# EAGLE design instrument_generic (EAGLE 9.2.2)
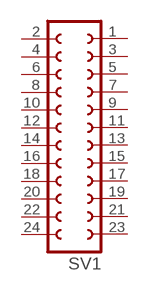
[diagram p0: schematic, sheet 1]

## Parts
SV1  FE12-2  [FE12-2]
Unconnected: SV1.1 SV1.2 SV1.3 SV1.4 SV1.5 SV1.6 SV1.7 SV1.8 SV1.9 SV1.10 SV1.11 SV1.12 SV1.13 SV1.14 SV1.15 SV1.16 SV1.17 SV1.18 SV1.19 SV1.20 SV1.21 SV1.22 SV1.23 SV1.24

## Library data of the parts
SV1 = con-lsta:FE12-2: FEMALE HEADER; OC_FARNELL: unknown; OC_NEWARK: unknown

## Board
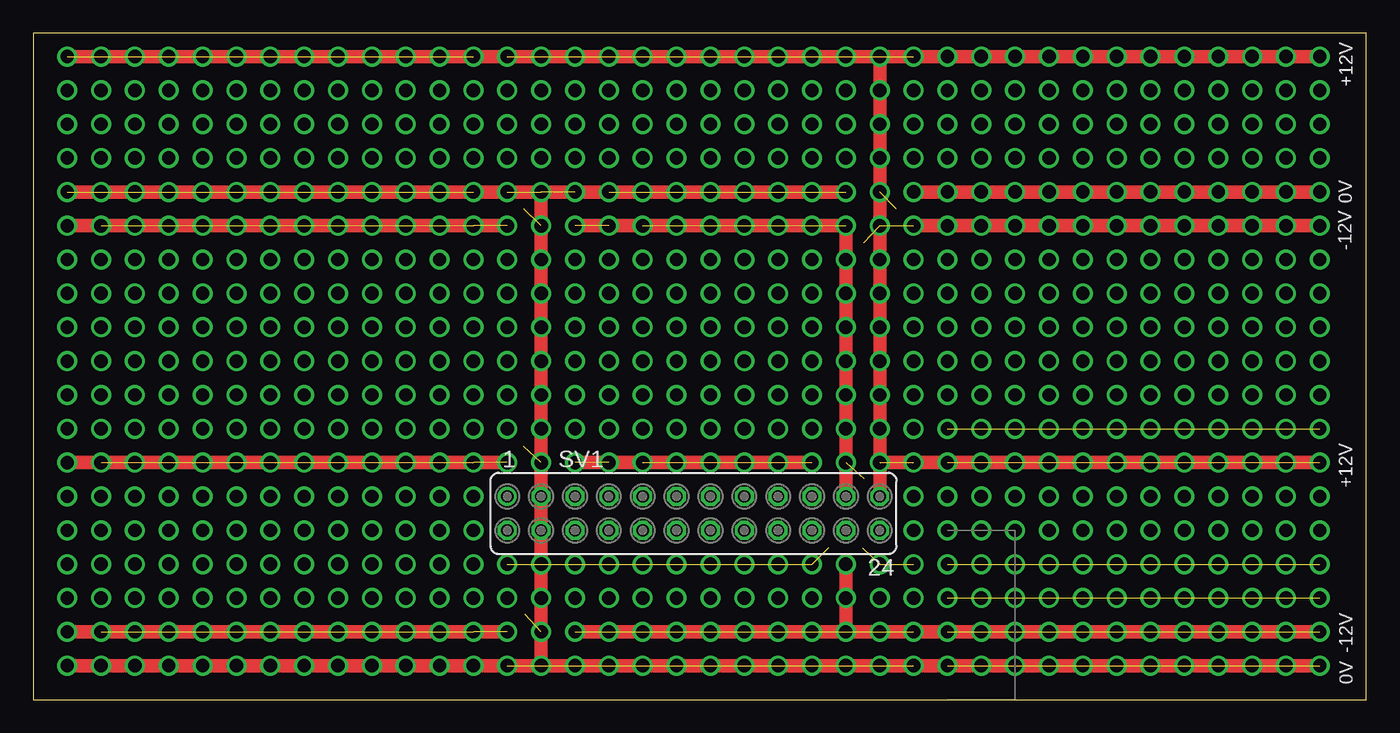
[diagram p1: board, top side]
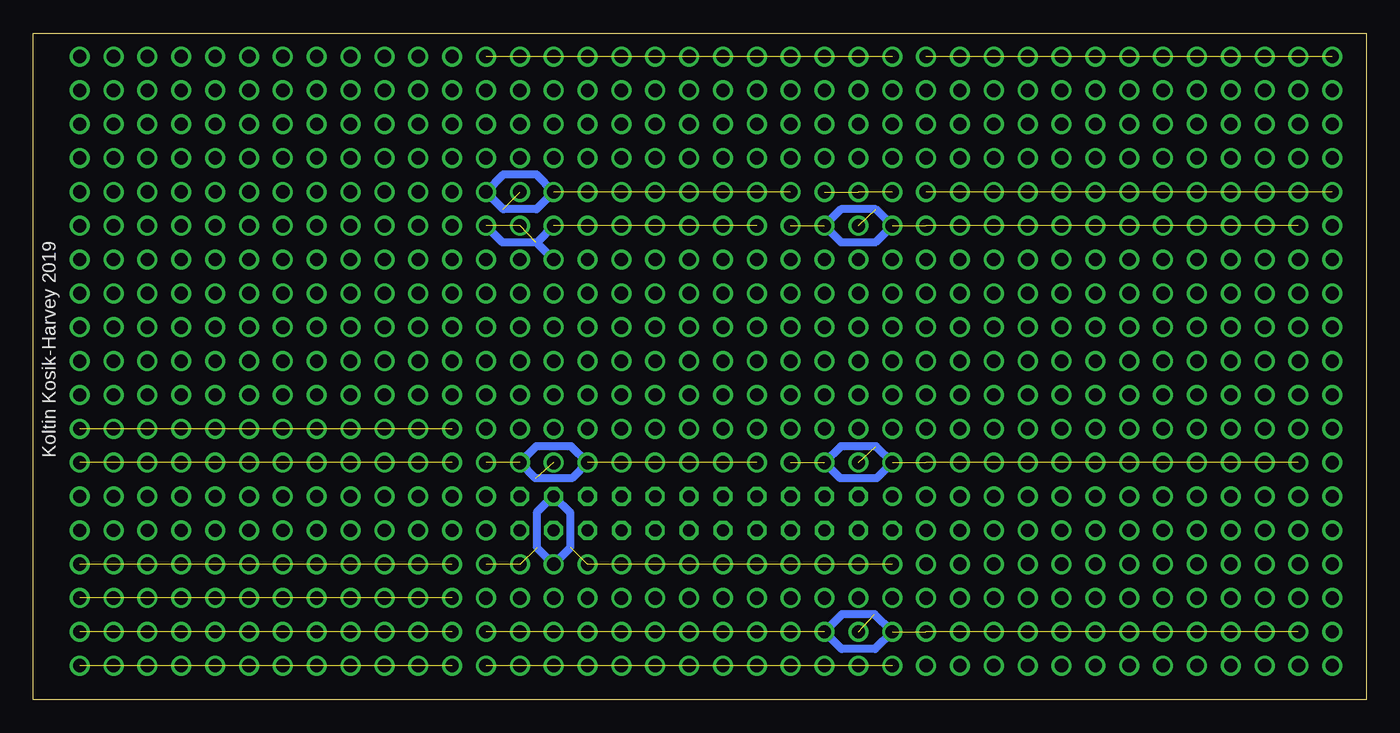
[diagram p2: board, bottom side, seen from below]

Size 100 x 50 mm. Coordinates in mm from the lower left corner, seen from the top.
Outline: 0,0 100,0 100,50 0,50 0,0
Copper layers (1*16): Top 0.035mm / dielectric 1.5mm / Bottom 0.035mm
Design rules "default": minimum track width 6mil, minimum drill 0.35mm, track to track 6mil, track to pad 6mil, pad to pad 6mil, via to via 6mil, smd to smd 6mil, copper to edge 40mil, drill to drill 6mil, minimum pad ring 10mil, minimum via ring 8mil, stop-mask expansion 4mil, vias tented up to drill 0mil, thermal gap 10mil

### Footprints (pad centres in the part's own frame; a part is rotated, then mirrored left to right if it is on the bottom)
FE12-2 = drill 0.914: 1 -13.97,1.27 | drill 0.914 octagon: 2 -13.97,-1.27; 3 -11.43,1.27; 4 -11.43,-1.27; 5 -8.89,1.27; 6 -8.89,-1.27; 7 -6.35,1.27; 8 -6.35,-1.27; 9 -3.81,1.27; 10 -3.81,-1.27; 11 -1.27,1.27; 12 -1.27,-1.27; 13 1.27,1.27; 14 1.27,-1.27; 15 3.81,1.27; 16 3.81,-1.27; 17 6.35,1.27; 18 6.35,-1.27; 19 8.89,1.27; 20 8.89,-1.27; 21 11.43,1.27; 22 11.43,-1.27; 23 13.97,1.27; 24 13.97,-1.27

### Placement (x,y rotation side)
SV1  49.53,13.97 0 top

### Tracks (layer width: path | path; a pad name or v marks a point on that pad's centre or on a via)
N$1  (via drill 1)
  other vias: 33.02,12.7 30.48,12.7 27.94,12.7 25.4,12.7 22.86,12.7 20.32,12.7 17.78,12.7 15.24,12.7 12.7,12.7 10.16,12.7 7.62,12.7 5.08,12.7 2.54,12.7
N$2  (via drill 1)
  other vias: 33.02,10.16 30.48,10.16 27.94,10.16 25.4,10.16 22.86,10.16 20.32,10.16 17.78,10.16 15.24,10.16 12.7,10.16 10.16,10.16 7.62,10.16 5.08,10.16 2.54,10.16
N$3  (via drill 1)
  other vias: 33.02,7.62 30.48,7.62 27.94,7.62 25.4,7.62 22.86,7.62 20.32,7.62 17.78,7.62 15.24,7.62 12.7,7.62 10.16,7.62 7.62,7.62 5.08,7.62 2.54,7.62
N$4  (via drill 1)
  other vias: 33.02,20.32 30.48,20.32 27.94,20.32 25.4,20.32 22.86,20.32 20.32,20.32 17.78,20.32 15.24,20.32 12.7,20.32 10.16,20.32 7.62,20.32 5.08,20.32 2.54,20.32
N$5  (via drill 1)  (12 unrouted)
  Top 1.016: v2.54,17.78 35.56,17.78
  other vias: 33.02,17.78 30.48,17.78 27.94,17.78 25.4,17.78 22.86,17.78 20.32,17.78 17.78,17.78 15.24,17.78 12.7,17.78 10.16,17.78 7.62,17.78 5.08,17.78
N$6  (via drill 1)
  other vias: 33.02,15.24 30.48,15.24 27.94,15.24 25.4,15.24 22.86,15.24 20.32,15.24 17.78,15.24 15.24,15.24 12.7,15.24 10.16,15.24 7.62,15.24 5.08,15.24 2.54,15.24
N$7  (via drill 1)  (12 unrouted)
  Top 1.016: v2.54,5.08 35.56,5.08
  other vias: 33.02,5.08 30.48,5.08 27.94,5.08 25.4,5.08 22.86,5.08 20.32,5.08 17.78,5.08 15.24,5.08 12.7,5.08 10.16,5.08 7.62,5.08 5.08,5.08
N$8  (via drill 1)
  other vias: 33.02,2.54 30.48,2.54 27.94,2.54 25.4,2.54 22.86,2.54 20.32,2.54 17.78,2.54 15.24,2.54 12.7,2.54 10.16,2.54 7.62,2.54 5.08,2.54 2.54,2.54
N$9  (via drill 1)  (12 unrouted)
  Top 1.016: v60.96,10.16 60.96,5.08 40.64,5.08
  Bottom 0.61: v60.96,10.16 59.7,11.42 59.7,14 61,15.3 62.2,14.1 62.2,11.4 v60.96,10.16
  other vias: 66.04,10.16 63.5,10.16 58.42,10.16 55.88,10.16 53.34,10.16 50.8,10.16 48.26,10.16 45.72,10.16 43.18,10.16 40.64,10.16 38.1,10.16 35.56,10.16
N$10  (via drill 1)
  other vias: 66.04,7.62 63.5,7.62 60.96,7.62 58.42,7.62 55.88,7.62 53.34,7.62 50.8,7.62 48.26,7.62 45.72,7.62 43.18,7.62 40.64,7.62 38.1,7.62 35.56,7.62
N$11  (via drill 1)  (11 unrouted)
  Top 1.016: v60.96,5.08 96.52,5.08
  Bottom 0.61: v35.56,5.08 36.84,3.8 39.36,3.8 v40.64,5.08 39.32,6.4 36.88,6.4 v35.56,5.08
  other vias: 66.04,5.08 63.5,5.08 58.42,5.08 55.88,5.08 53.34,5.08 50.8,5.08 48.26,5.08 45.72,5.08 43.18,5.08 38.1,5.08
N$12  (via drill 1)  (12 unrouted)
  Top 1.016: v38.1,2.54 2.54,2.54
  other vias: 66.04,2.54 63.5,2.54 60.96,2.54 58.42,2.54 55.88,2.54 53.34,2.54 50.8,2.54 48.26,2.54 45.72,2.54 43.18,2.54 40.64,2.54 35.56,2.54
N$13  (via drill 1)  (11 unrouted)
  other vias: 96.52,10.16 93.98,10.16 91.44,10.16 88.9,10.16 86.36,10.16 83.82,10.16 81.28,10.16 78.74,10.16 76.2,10.16 73.66,10.16 71.12,10.16 68.58,10.16
N$14  (via drill 1)  (11 unrouted)
  other vias: 96.52,7.62 93.98,7.62 91.44,7.62 88.9,7.62 86.36,7.62 83.82,7.62 81.28,7.62 78.74,7.62 76.2,7.62 73.66,7.62 71.12,7.62 68.58,7.62
N$15  (via drill 1)  (11 unrouted)
  other vias: 96.52,5.08 93.98,5.08 91.44,5.08 88.9,5.08 86.36,5.08 83.82,5.08 81.28,5.08 78.74,5.08 76.2,5.08 73.66,5.08 71.12,5.08 68.58,5.08
N$16  (via drill 1)  (11 unrouted)
  other vias: 96.52,2.54 93.98,2.54 91.44,2.54 88.9,2.54 86.36,2.54 83.82,2.54 81.28,2.54 78.74,2.54 76.2,2.54 73.66,2.54 71.12,2.54 68.58,2.54
N$17  (via drill 1)
  other vias: 33.02,30.48 30.48,30.48 27.94,30.48 25.4,30.48 22.86,30.48 20.32,30.48 17.78,30.48 15.24,30.48 12.7,30.48 10.16,30.48 7.62,30.48 5.08,30.48 2.54,30.48
N$18  (via drill 1)
  other vias: 33.02,27.94 30.48,27.94 27.94,27.94 25.4,27.94 22.86,27.94 20.32,27.94 17.78,27.94 15.24,27.94 12.7,27.94 10.16,27.94 7.62,27.94 5.08,27.94 2.54,27.94
N$19  (via drill 1)
  other vias: 33.02,25.4 30.48,25.4 27.94,25.4 25.4,25.4 22.86,25.4 20.32,25.4 17.78,25.4 15.24,25.4 12.7,25.4 10.16,25.4 7.62,25.4 5.08,25.4 2.54,25.4
N$20  (via drill 1)
  other vias: 33.02,22.86 30.48,22.86 27.94,22.86 25.4,22.86 22.86,22.86 20.32,22.86 17.78,22.86 15.24,22.86 12.7,22.86 10.16,22.86 7.62,22.86 5.08,22.86 2.54,22.86
N$21  (via drill 1)
  other vias: 66.04,30.48 63.5,30.48 60.96,30.48 58.42,30.48 55.88,30.48 53.34,30.48 50.8,30.48 48.26,30.48 45.72,30.48 43.18,30.48 40.64,30.48 38.1,30.48 35.56,30.48
N$22  (via drill 1)
  other vias: 66.04,27.94 63.5,27.94 60.96,27.94 58.42,27.94 55.88,27.94 53.34,27.94 50.8,27.94 48.26,27.94 45.72,27.94 43.18,27.94 40.64,27.94 38.1,27.94 35.56,27.94
N$23  (via drill 1)
  other vias: 66.04,25.4 63.5,25.4 60.96,25.4 58.42,25.4 55.88,25.4 53.34,25.4 50.8,25.4 48.26,25.4 45.72,25.4 43.18,25.4 40.64,25.4 38.1,25.4 35.56,25.4
N$24  (via drill 1)
  other vias: 66.04,22.86 63.5,22.86 60.96,22.86 58.42,22.86 55.88,22.86 53.34,22.86 50.8,22.86 48.26,22.86 45.72,22.86 43.18,22.86 40.64,22.86 38.1,22.86 35.56,22.86
N$25  (via drill 1)
  other vias: 96.52,30.48 93.98,30.48 91.44,30.48 88.9,30.48 86.36,30.48 83.82,30.48 81.28,30.48 78.74,30.48 76.2,30.48 73.66,30.48 71.12,30.48 68.58,30.48
N$26  (via drill 1)
  other vias: 96.52,27.94 93.98,27.94 91.44,27.94 88.9,27.94 86.36,27.94 83.82,27.94 81.28,27.94 78.74,27.94 76.2,27.94 73.66,27.94 71.12,27.94 68.58,27.94
N$27  (via drill 1)
  other vias: 96.52,25.4 93.98,25.4 91.44,25.4 88.9,25.4 86.36,25.4 83.82,25.4 81.28,25.4 78.74,25.4 76.2,25.4 73.66,25.4 71.12,25.4 68.58,25.4
N$28  (via drill 1)
  other vias: 96.52,22.86 93.98,22.86 91.44,22.86 88.9,22.86 86.36,22.86 83.82,22.86 81.28,22.86 78.74,22.86 76.2,22.86 73.66,22.86 71.12,22.86 68.58,22.86
N$29  (via drill 1)
  other vias: 33.02,40.64 30.48,40.64 27.94,40.64 25.4,40.64 22.86,40.64 20.32,40.64 17.78,40.64 15.24,40.64 12.7,40.64 10.16,40.64 7.62,40.64 5.08,40.64 2.54,40.64
N$30  (via drill 1)  (12 unrouted)
  Top 1.016: v2.54,38.1 38.1,38.1
  other vias: 33.02,38.1 30.48,38.1 27.94,38.1 25.4,38.1 22.86,38.1 20.32,38.1 17.78,38.1 15.24,38.1 12.7,38.1 10.16,38.1 7.62,38.1 5.08,38.1
N$31  (via drill 1)  (12 unrouted)
  Top 1.016: v2.54,35.56 35.56,35.56
  other vias: 33.02,35.56 30.48,35.56 27.94,35.56 25.4,35.56 22.86,35.56 20.32,35.56 17.78,35.56 15.24,35.56 12.7,35.56 10.16,35.56 7.62,35.56 5.08,35.56
N$32  (via drill 1)
  other vias: 33.02,33.02 30.48,33.02 27.94,33.02 25.4,33.02 22.86,33.02 20.32,33.02 17.78,33.02 15.24,33.02 12.7,33.02 10.16,33.02 7.62,33.02 5.08,33.02 2.54,33.02
N$33  (via drill 1)
  other vias: 66.04,40.64 63.5,40.64 60.96,40.64 58.42,40.64 55.88,40.64 53.34,40.64 50.8,40.64 48.26,40.64 45.72,40.64 43.18,40.64 40.64,40.64 38.1,40.64 35.56,40.64
N$34  (via drill 1)  (10 unrouted)
  Top 1.016: v60.96,38.1 v38.1,38.1 38.1,2.54 96.52,2.54 | v66.04,38.1 96.52,38.1
  Bottom 0.61: v60.96,38.1 62.26,36.8 64.74,36.8 v66.04,38.1 64.74,39.4 62.26,39.4 v60.96,38.1
  other vias: 63.5,38.1 58.42,38.1 55.88,38.1 53.34,38.1 50.8,38.1 48.26,38.1 45.72,38.1 43.18,38.1 40.64,38.1 35.56,38.1
N$35  (via drill 1)  (10 unrouted)
  Top 1.016: 60.96,15.24 v60.96,35.56 v40.64,35.56 | v66.04,35.56 96.52,35.56
  Bottom 0.61: v60.96,35.56 62.22,34.3 62.3,34.3 | v35.56,35.56 36.8,36.8 39.4,36.8 v40.64,35.56 39.38,34.3 36.82,34.3 v35.56,35.56
  other vias: 63.5,35.56 58.42,35.56 55.88,35.56 53.34,35.56 50.8,35.56 48.26,35.56 45.72,35.56 43.18,35.56 38.1,35.56
N$36  (via drill 1)
  Bottom 0.61: v60.96,33.02 62.24,34.3 63.5,34.3 64.8,34.3 66.1,35.6
  other vias: 66.04,33.02 63.5,33.02 58.42,33.02 55.88,33.02 53.34,33.02 50.8,33.02 48.26,33.02 45.72,33.02 43.18,33.02 40.64,33.02 38.1,33.02 35.56,33.02
N$37  (via drill 1)
  other vias: 96.52,40.64 93.98,40.64 91.44,40.64 88.9,40.64 86.36,40.64 83.82,40.64 81.28,40.64 78.74,40.64 76.2,40.64 73.66,40.64 71.12,40.64 68.58,40.64
N$38  (via drill 1)
  other vias: 96.52,38.1 93.98,38.1 91.44,38.1 88.9,38.1 86.36,38.1 83.82,38.1 81.28,38.1 78.74,38.1 76.2,38.1 73.66,38.1 71.12,38.1 68.58,38.1
N$39  (via drill 1)
  other vias: 96.52,35.56 93.98,35.56 91.44,35.56 88.9,35.56 86.36,35.56 83.82,35.56 81.28,35.56 78.74,35.56 76.2,35.56 73.66,35.56 71.12,35.56 68.58,35.56
N$40  (via drill 1)
  other vias: 96.52,33.02 93.98,33.02 91.44,33.02 88.9,33.02 86.36,33.02 83.82,33.02 81.28,33.02 78.74,33.02 76.2,33.02 73.66,33.02 71.12,33.02 68.58,33.02
N$41  (via drill 1)  (12 unrouted)
  Top 1.016: v2.54,48.26 96.52,48.26
  other vias: 33.02,48.26 30.48,48.26 27.94,48.26 25.4,48.26 22.86,48.26 20.32,48.26 17.78,48.26 15.24,48.26 12.7,48.26 10.16,48.26 7.62,48.26 5.08,48.26
N$42  (via drill 1)
  other vias: 33.02,45.72 30.48,45.72 27.94,45.72 25.4,45.72 22.86,45.72 20.32,45.72 17.78,45.72 15.24,45.72 12.7,45.72 10.16,45.72 7.62,45.72 5.08,45.72 2.54,45.72
N$43  (via drill 1)
  other vias: 33.02,43.18 30.48,43.18 27.94,43.18 25.4,43.18 22.86,43.18 20.32,43.18 17.78,43.18 15.24,43.18 12.7,43.18 10.16,43.18 7.62,43.18 5.08,43.18 2.54,43.18
N$44  (via drill 1)  (12 unrouted)
  Top 1.016: v63.5,48.26 63.5,15.24
  other vias: 66.04,48.26 60.96,48.26 58.42,48.26 55.88,48.26 53.34,48.26 50.8,48.26 48.26,48.26 45.72,48.26 43.18,48.26 40.64,48.26 38.1,48.26 35.56,48.26
N$45  (via drill 1)
  other vias: 66.04,45.72 63.5,45.72 60.96,45.72 58.42,45.72 55.88,45.72 53.34,45.72 50.8,45.72 48.26,45.72 45.72,45.72 43.18,45.72 40.64,45.72 38.1,45.72 35.56,45.72
N$46  (via drill 1)
  other vias: 66.04,43.18 63.5,43.18 60.96,43.18 58.42,43.18 55.88,43.18 53.34,43.18 50.8,43.18 48.26,43.18 45.72,43.18 43.18,43.18 40.64,43.18 38.1,43.18 35.56,43.18
N$47  (via drill 1)
  other vias: 96.52,48.26 93.98,48.26 91.44,48.26 88.9,48.26 86.36,48.26 83.82,48.26 81.28,48.26 78.74,48.26 76.2,48.26 73.66,48.26 71.12,48.26 68.58,48.26
N$48  (via drill 1)
  other vias: 96.52,45.72 93.98,45.72 91.44,45.72 88.9,45.72 86.36,45.72 83.82,45.72 81.28,45.72 78.74,45.72 76.2,45.72 73.66,45.72 71.12,45.72 68.58,45.72
N$49  (via drill 1)
  other vias: 96.52,43.18 93.98,43.18 91.44,43.18 88.9,43.18 86.36,43.18 83.82,43.18 81.28,43.18 78.74,43.18 76.2,43.18 73.66,43.18 71.12,43.18 68.58,43.18
N$50  (via drill 1)
  other vias: 66.04,20.32 63.5,20.32 60.96,20.32 58.42,20.32 55.88,20.32 53.34,20.32 50.8,20.32 48.26,20.32 45.72,20.32 43.18,20.32 40.64,20.32 38.1,20.32 35.56,20.32
N$51  (via drill 1)  (9 unrouted)
  Top 1.016: v63.5,17.78 96.52,17.78 | v40.64,17.78 v58.42,17.78
  Bottom 0.61: v35.56,17.78 36.74,16.6 39.46,16.6 v40.64,17.78 39.42,19 36.78,19 v35.56,17.78 | v58.42,17.78 59.6,16.6 62.32,16.6 v63.5,17.78 62.28,19 59.64,19 v58.42,17.78
  other vias: 66.04,17.78 60.96,17.78 55.88,17.78 53.34,17.78 50.8,17.78 48.26,17.78 45.72,17.78 43.18,17.78 38.1,17.78
N$52  (via drill 1)  (11 unrouted)
  other vias: 96.52,20.32 93.98,20.32 91.44,20.32 88.9,20.32 86.36,20.32 83.82,20.32 81.28,20.32 78.74,20.32 76.2,20.32 73.66,20.32 71.12,20.32 68.58,20.32
N$53  (via drill 1)
  other vias: 96.52,15.24 93.98,15.24 91.44,15.24 88.9,15.24 86.36,15.24 83.82,15.24 81.28,15.24 78.74,15.24 76.2,15.24 73.66,15.24 71.12,15.24 68.58,15.24 66.04,15.24
N$54  (via drill 1)
  other vias: 96.52,12.7 93.98,12.7 91.44,12.7 88.9,12.7 86.36,12.7 83.82,12.7 81.28,12.7 78.74,12.7 76.2,12.7 73.66,12.7 71.12,12.7 68.58,12.7 66.04,12.7
N$55  (via drill 1)  (11 unrouted)
  other vias: 96.52,17.78 93.98,17.78 91.44,17.78 88.9,17.78 86.36,17.78 83.82,17.78 81.28,17.78 78.74,17.78 76.2,17.78 73.66,17.78 71.12,17.78 68.58,17.78

### Text on the board
tPlace: +12V | 0V | -12V | +12V | -12V | 0V
bPlace: Koltin Kosik-Harvey 2019